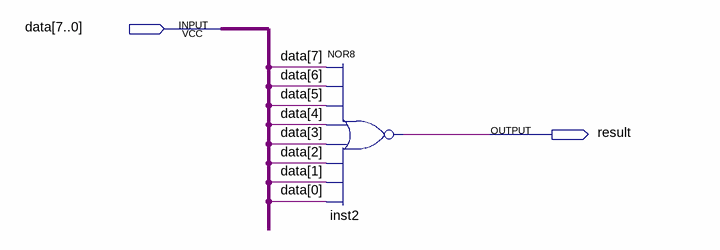
[diagram p0: schematic sheet]
// Quartus schematic alu_logic_flag_zero.bdf as structural Verilog: 1 symbols, 2 pins
module alu_logic_flag_zero (
  input  [7:0] data,
  output result
);

  nor inst2 (result, data[7], data[6], data[5], data[4], data[3], data[2], data[1], data[0]);
endmodule
